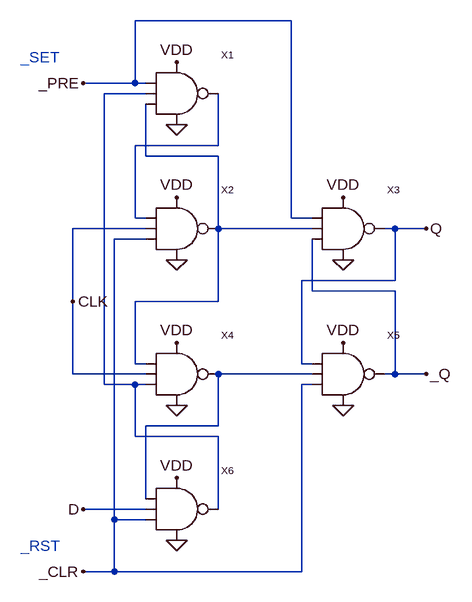
[diagram p0: schematic 3to1NAND_DFF_x1.asc]
3to1NAND_DFF_x1.asc, the LTspice schematic file:
Version 4
SHEET 1 1180 928
WIRE 368 0 128 0
WIRE 128 96 128 0
WIRE 128 96 48 96
WIRE 144 96 128 96
WIRE 144 112 80 112
WIRE 256 192 256 112
WIRE 256 192 128 192
WIRE 144 208 144 128
WIRE 256 208 144 208
WIRE 128 304 128 192
WIRE 144 304 128 304
WIRE 368 304 368 0
WIRE 400 304 368 304
WIRE 144 320 32 320
WIRE 256 320 256 208
WIRE 400 320 256 320
WIRE 528 320 512 320
WIRE 576 320 528 320
WIRE 144 336 96 336
WIRE 528 400 528 320
WIRE 528 400 384 400
WIRE 400 416 400 336
WIRE 528 416 400 416
WIRE 32 432 32 320
WIRE 256 432 256 320
WIRE 256 432 128 432
WIRE 128 528 128 432
WIRE 144 528 128 528
WIRE 384 528 384 400
WIRE 400 528 384 528
WIRE 32 544 32 432
WIRE 144 544 32 544
WIRE 400 544 256 544
WIRE 528 544 528 416
WIRE 528 544 512 544
WIRE 576 544 528 544
WIRE 80 560 80 112
WIRE 128 560 80 560
WIRE 144 560 128 560
WIRE 400 560 384 560
WIRE 256 624 256 544
WIRE 256 624 144 624
WIRE 128 640 128 560
WIRE 256 640 128 640
WIRE 144 736 144 624
WIRE 144 752 48 752
WIRE 256 752 256 640
WIRE 96 768 96 336
WIRE 144 768 96 768
WIRE 96 848 96 768
WIRE 96 848 48 848
WIRE 384 848 384 560
WIRE 384 848 96 848
FLAG 192 64 VDD
FLAG 192 272 VDD
FLAG 448 272 VDD
FLAG 448 496 VDD
FLAG 192 496 VDD
FLAG 192 704 VDD
FLAG 192 160 0
FLAG 192 368 0
FLAG 448 368 0
FLAG 448 592 0
FLAG 192 592 0
FLAG 192 800 0
FLAG 48 96 _PRE
FLAG 32 432 CLK
FLAG 48 752 D
FLAG 48 848 _CLR
FLAG 576 320 Q
FLAG 576 544 _Q
SYMBOL 3to1NAND_x1 176 128 R0
SYMATTR InstName X1
SYMBOL 3to1NAND_x1 176 336 R0
SYMATTR InstName X2
SYMBOL 3to1NAND_x1 432 336 R0
SYMATTR InstName X3
SYMBOL 3to1NAND_x1 176 560 R0
SYMATTR InstName X4
SYMBOL 3to1NAND_x1 432 560 R0
SYMATTR InstName X5
SYMBOL 3to1NAND_x1 176 768 R0
SYMATTR InstName X6
TEXT -48 56 Left 2 ;_SET
TEXT -48 808 Left 2 ;_RST

The netlist it stands for:
* 3to1NAND_DFF_x1.asc
XX1 _PRE N001 N003 VDD 0 N002 3to1NAND_x1  ; pins A B C VDD VSS OUT
XX2 N002 CLK _CLR VDD 0 N003 3to1NAND_x1  ; pins A B C VDD VSS OUT
XX3 _PRE N003 _Q VDD 0 Q 3to1NAND_x1  ; pins A B C VDD VSS OUT
XX4 N003 CLK N001 VDD 0 N004 3to1NAND_x1  ; pins A B C VDD VSS OUT
XX5 Q N004 _CLR VDD 0 _Q 3to1NAND_x1  ; pins A B C VDD VSS OUT
XX6 N004 D _CLR VDD 0 N001 3to1NAND_x1  ; pins A B C VDD VSS OUT
* _SET
* _RST
.backanno
.end